# EAGLE schematic untitled (EAGLE 6.6.0)
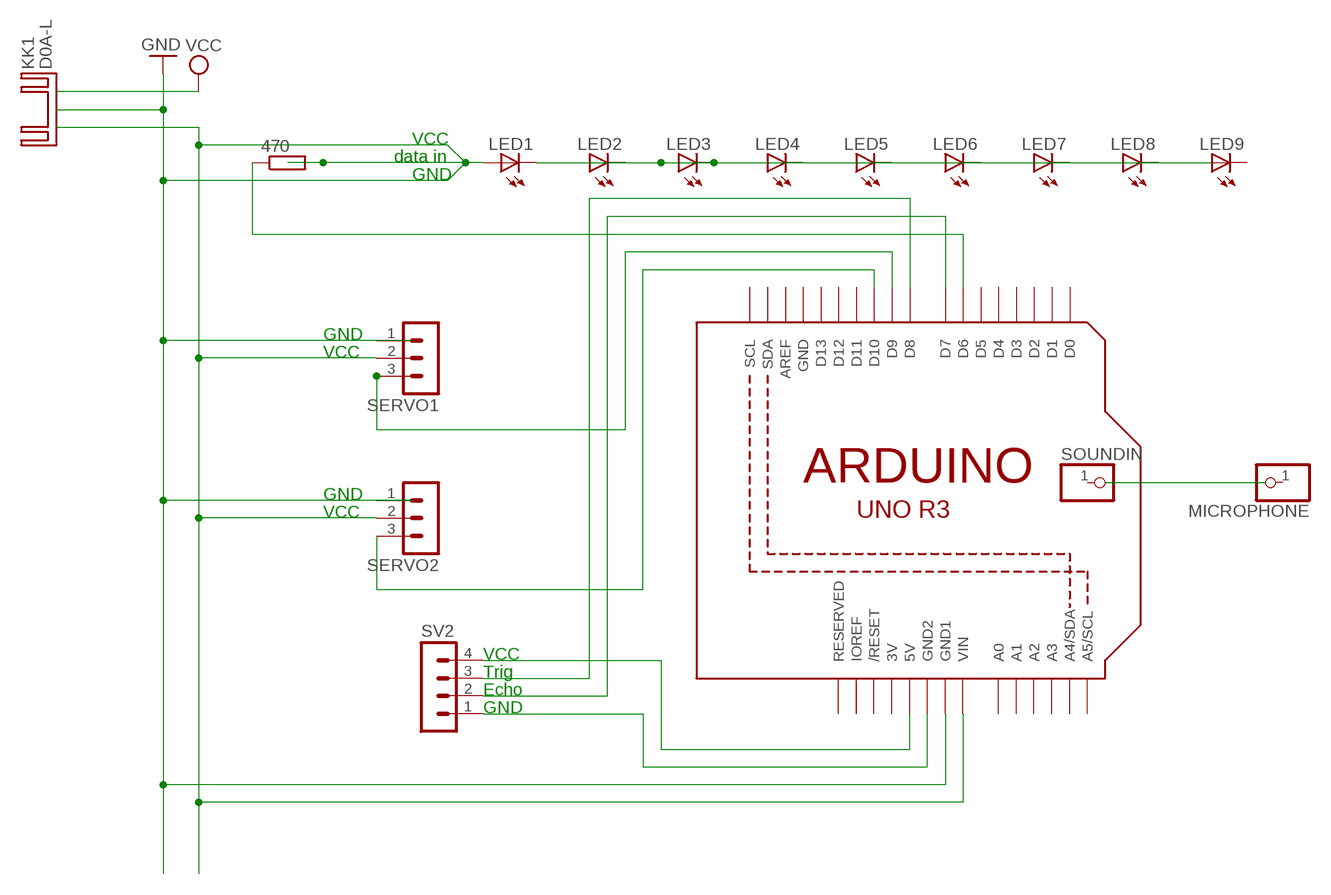
[diagram p0: schematic, sheet 1]

## Parts
470  R-EU_0204/7  [0204/7]
KK1  D0A-L  [D02A-L]
LED1  LED  [SMARTLED-TTW]
LED2  LED  [SMARTLED-TTW]
LED3  LED  [SMARTLED-TTW]
LED4  LED  [SMARTLED-TTW]
LED5  LED  [SMARTLED-TTW]
LED6  LED  [SMARTLED-TTW]
LED7  LED  [SMARTLED-TTW]
LED8  LED  [SMARTLED-TTW]
LED9  LED  [SMARTLED-TTW]
MICROPHONE  PINHD-1X1  [1X01]
SERVO1  MA03-1  [MA03-1]
SERVO2  MA03-1  [MA03-1]
SOUNDIN  PINHD-1X1  [1X01]
SV2  MA04-1  [MA04-1]
U1  ARDUINOR3-DIMENSION  [ARDUINOR3]

## Nets
GND: 470.2 LED1.A@1(A) SERVO1.1 SERVO1.2 SERVO2.1 SERVO2.2 U1.GND1 U1.VIN
N$1: LED1.C@1(C) LED3.A@1(A) LED3.C@1(C)
N$2: SERVO1.3 U1.D9
N$3: 470.1 U1.D6
N$4: SERVO2.3 U1.D10
N$5: SV2.1 U1.GND2
N$6: SV2.2 U1.D7
N$7: SV2.4 U1.5V
N$8: SV2.3 U1.D8
Unconnected: LED2.A@1(A) LED2.C@1(C) LED4.A@1(A) LED4.C@1(C) LED5.A@1(A) LED5.C@1(C) LED6.A@1(A) LED6.C@1(C) LED7.A@1(A) LED7.C@1(C) LED8.A@1(A) LED8.C@1(C) LED9.A@1(A) LED9.C@1(C) MICROPHONE.1 SOUNDIN.1 U1.A0 U1.A1 U1.A2 U1.A3 U1.A4(A4/SDA) U1.A5(A5/SCL) U1.AREF U1.D0 U1.D1 U1.D2 U1.D3 U1.D4 U1.D5 U1.D11 U1.D12 U1.D13 U1.IOREF U1.RESERVED U1.RESET(/RESET) U1.SCL U1.SDA

## Notes on the sheet
- VCC
- data in
- GND
- GND
- VCC
- GND
- VCC
- VCC
- Trig
- Echo
- GND

## Power pins joined to a net without a drawn wire
3V: U1.3V
GND: U1.GND

## Library data of the parts
470 = rcl:R-EU_: RESISTOR, European symbol
KK1 = heatsink:D0A-L: HEATSINK distributor Schukat
LED1-LED9 = adafruit:LED: LED OSRAM: - CHIPLED LG R971, LG N971, LY N971, LG Q971, LY Q971, LO R971, LY R971 LH N974, LH R974 LS Q976, LO Q976, LY Q976 LO Q996 - Hyper CHIPLED LW Q18S LB Q993, LB Q99A, LB R99A - SideLED LS A670, LO A670, LY A670, LG A670, LP A670 LB A673, LV A673, LT A673, LW A673 LH A674 LY A675 LS A676, LA A676, LO A676, LY A676, LW A676 LS A679, LY A679, LG A679 - Hyper Micro SIDELED® LS Y876, LA Y876, LO Y876, LY Y876 LT Y87S - SmartLED LW L88C, LW L88S LB L89C, LB L89S, LG L890 LS L89K, LO L89K, LY L89K LS L896, LA L896, LO L896, LY L896 - TOPLED LS T670, LO T670, LY T670, LG T670, LP T670 LSG T670, LSP T670, LSY T670, LOP T670, LYG T670 LG T671, LOG T671, LSG T671 LB T673, LV T673, LT T673, LW T673 LH T674 LS T676, LA T676, LO T676, LY T676, LB T676, LH T676, LSB T676, LW T676 LB T67C, LV T67C, LT T67C, LS T67K, LO T67K, LY T67K, LW E67C LS E67B, LA E67B, LO E67B, LY E67B, LB E67C, LV E67C, LT E67C LW T67C LS T679, LY T679, LG T679 LS T770, LO T770, LY T770, LG T770, LP T770 LB T773, LV T773, LT T773, LW T773 LH T774 LS E675, LA E675, LY E675, LS T675 LS T776, LA T776, LO T776, LY T776, LB T776 LHGB T686 LT T68C, LB T68C - Hyper Mini TOPLED® LB M676 - Mini TOPLED Santana® LG M470 LS M47K, LO M47K, LY M47K Source: http://www.osram.convergy.de/
MICROPHONE SOUNDIN = adafruit:PINHD-1X1: Pin header 1x1 for 0.1" spacing With round pins
SERVO1 SERVO2 = con-lstb:MA03-1: PIN HEADER; OC_FARNELL: unknown; OC_NEWARK: unknown
SV2 = con-lstb:MA04-1: PIN HEADER; OC_FARNELL: unknown; OC_NEWARK: unknown
U1 = adafruit:ARDUINOR3: This is a new object for the new Arduino R3 - with extra pins that you may want to use (such as IOref, and duplicated A4/A5